# EAGLE design util-vco (EAGLE 6.6.0)
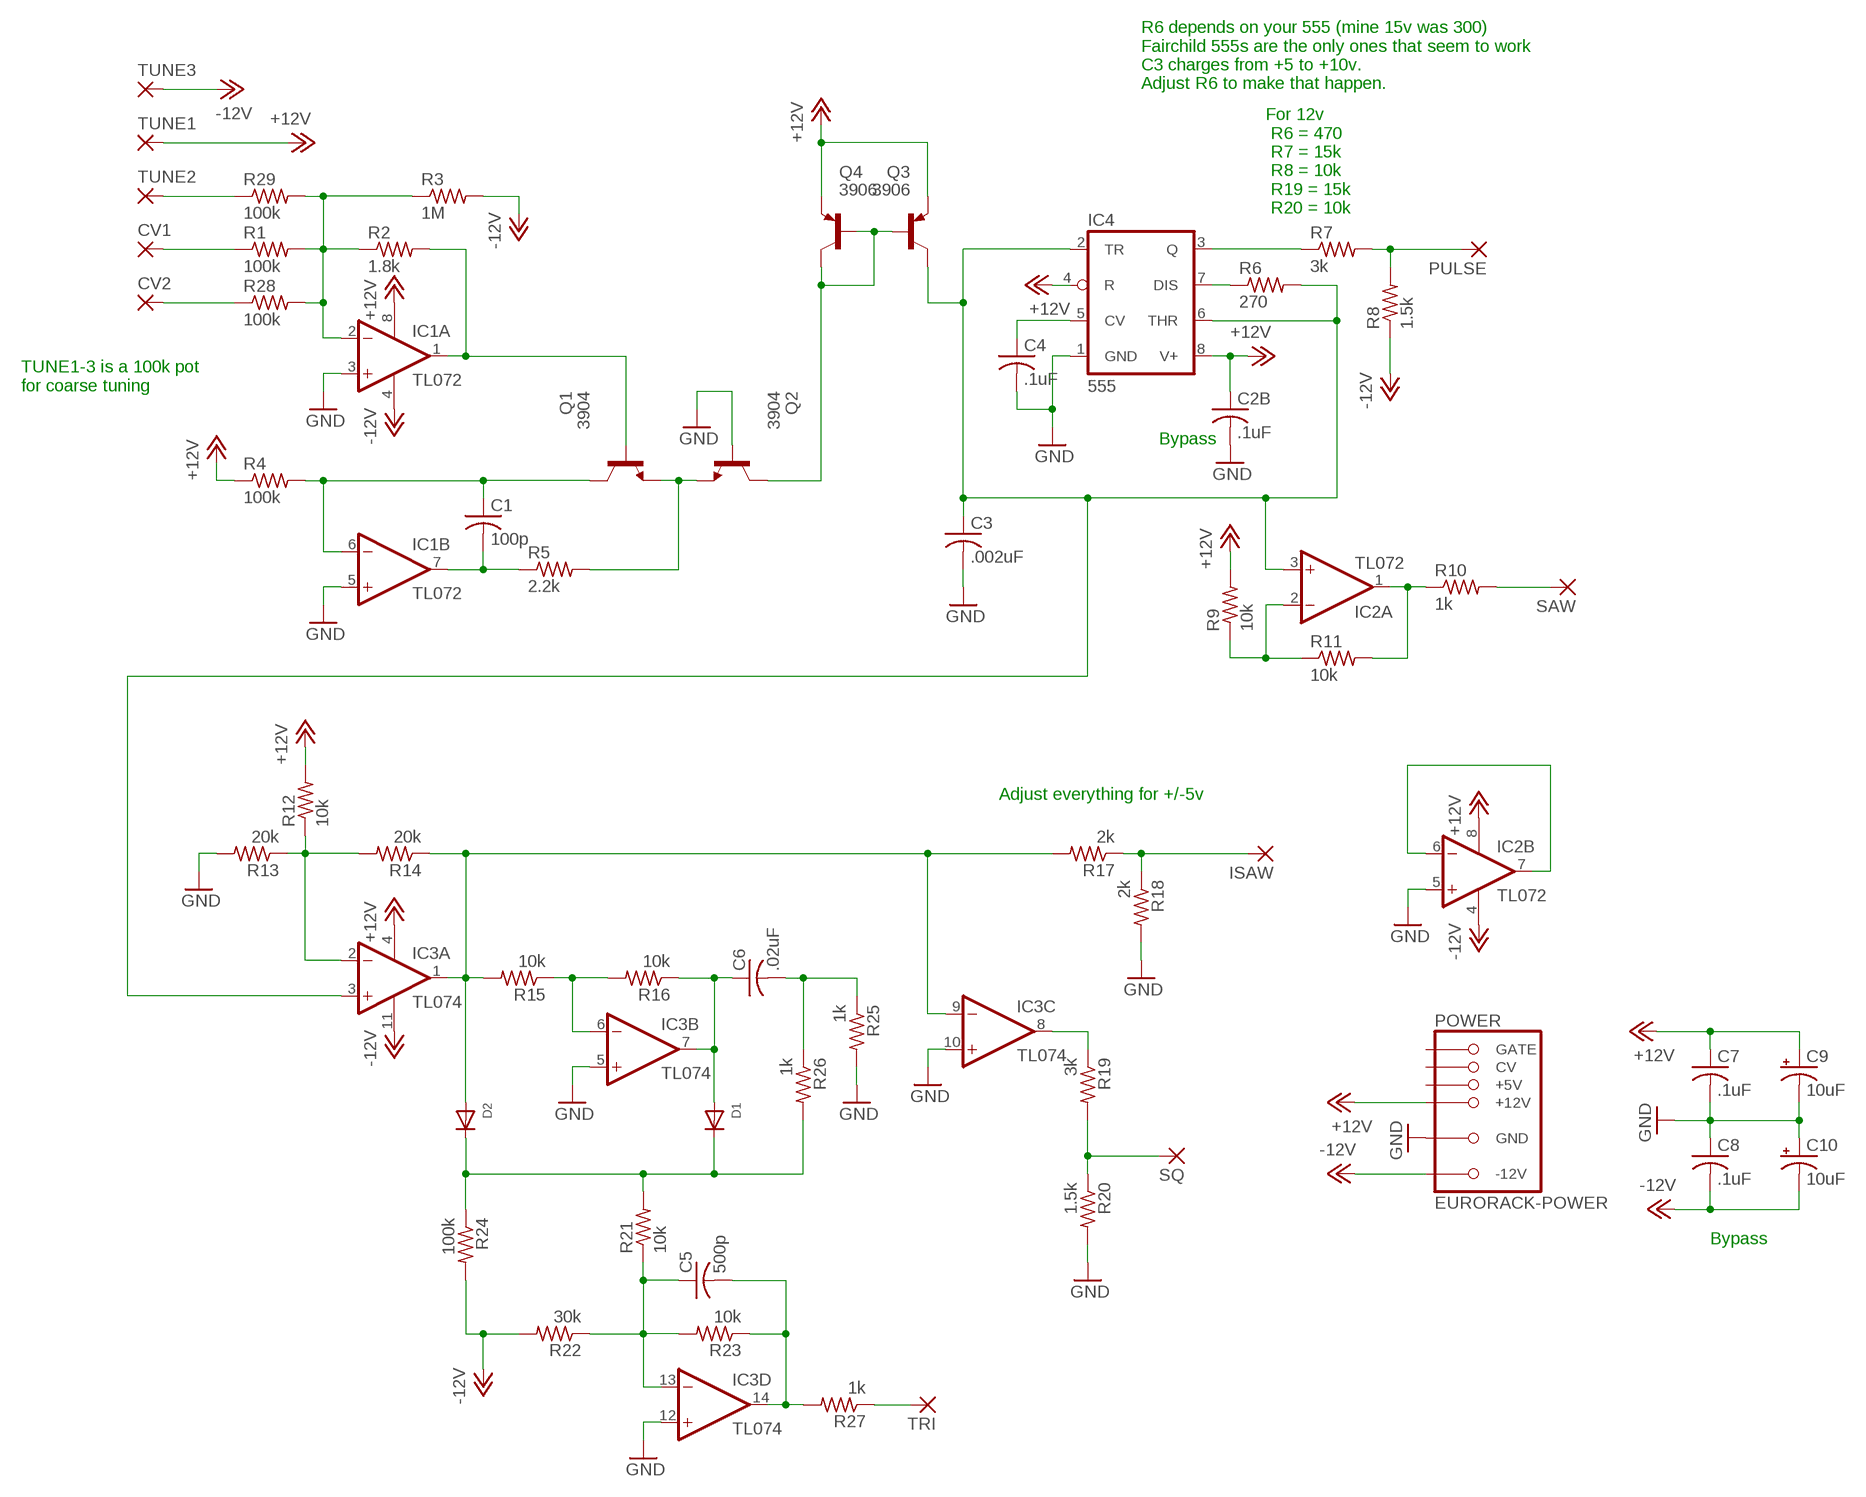
[diagram p0: schematic, sheet 1]

## Parts
C1  100p  C-US050-025X075  [C050-025X075]
C2B  .1uF  C-US050-025X075  [C050-025X075]
C3  .002uF  C-US050-025X075  [C050-025X075]
C4  .1uF  C-US050-025X075  [C050-025X075]
C5  500p  C-US050-025X075  [C050-025X075]
C6  .02uF  C-US050-025X075  [C050-025X075]
C7  .1uF  C-US050-025X075  [C050-025X075]
C8  .1uF  C-US050-025X075  [C050-025X075]
C9  10uF  CPOL-USE2.5-5  [E2,5-5]
C10  10uF  CPOL-USE2.5-5  [E2,5-5]
CV1  2,54/1,0  [2,54/1,0]
CV2  2,54/1,0  [2,54/1,0]
D1  DIODEDO-1N4148  [DO-1N4148]
D2  DIODEDO-1N4148  [DO-1N4148]
IC1  TL072  TL072-TOPP  [DIL08]
IC2  TL072  TL072-TOPP  [DIL08]
IC3  TL074  TL074-TOPP  [DIL14]
IC4  555  LM555N  [DIL08]
ISAW  2,54/1,0  [2,54/1,0]
POWER  EURORACK-POWER  [PINSHRD_PTH_2X8]
PULSE  2,54/1,0  [2,54/1,0]
Q1  3904  2N3904  [TO92]
Q2  3904  2N3904  [TO92]
Q3  3906  2N3906  [TO92]
Q4  3906  2N3906  [TO92]
R1  100k  R-US_0207/10  [0207/10]
R2  1.8k  R-US_0207/10  [0207/10]
R3  1M  R-US_0207/10  [0207/10]
R4  100k  R-US_0207/10  [0207/10]
R5  2.2k  R-US_0207/10  [0207/10]
R6  270  R-US_0207/10  [0207/10]
R7  3k  R-US_0207/10  [0207/10]
R8  1.5k  R-US_0207/10  [0207/10]
R9  10k  R-US_0207/10  [0207/10]
R10  1k  R-US_0207/10  [0207/10]
R11  10k  R-US_0207/10  [0207/10]
R12  10k  R-US_0207/10  [0207/10]
R13  20k  R-US_0207/10  [0207/10]
R14  20k  R-US_0207/10  [0207/10]
R15  10k  R-US_0207/10  [0207/10]
R16  10k  R-US_0207/10  [0207/10]
R17  2k  R-US_0207/10  [0207/10]
R18  2k  R-US_0207/10  [0207/10]
R19  3k  R-US_0207/10  [0207/10]
R20  1.5k  R-US_0207/10  [0207/10]
R21  10k  R-US_0207/10  [0207/10]
R22  30k  R-US_0207/10  [0207/10]
R23  10k  R-US_0207/10  [0207/10]
R24  100k  R-US_0207/10  [0207/10]
R25  1k  R-US_0207/10  [0207/10]
R26  1k  R-US_0207/10  [0207/10]
R27  1k  R-US_0207/10  [0207/10]
R28  100k  R-US_0207/10  [0207/10]
R29  100k  R-US_0207/10  [0207/10]
SAW  2,54/1,0  [2,54/1,0]
SQ  2,54/1,0  [2,54/1,0]
TRI  2,54/1,0  [2,54/1,0]
TUNE1  2,54/1,0  [2,54/1,0]
TUNE2  2,54/1,0  [2,54/1,0]
TUNE3  2,54/1,0  [2,54/1,0]

## Nets
+12V: C2B.1 C7.1 C9.+ IC1.8(P:V+) IC2.8(P:V+) IC3.4(P:V+) IC4.4(R) IC4.8(V+) POWER.+12V@1(+12V) POWER.+12V@2(+12V) Q3.3(E) Q4.3(E) R4.1 R9.2 R12.2 TUNE1.1(P)
-12V: C8.2 C10.- IC1.4(P:V-) IC2.4(P:V-) IC3.11(P:V-) POWER.-12V@1(-12V) POWER.-12V@2(-12V) R3.2 R8.1 R22.2 R24.2 TUNE3.1(P)
GND: C2B.2 C3.2 C4.2 C7.2 C8.1 C9.- C10.+ IC1.3(A:+IN) IC1.5(B:+IN) IC2.5(B:+IN) IC3.5(B:+IN) IC3.10(C:+IN) IC3.12(D:+IN) IC4.1(GND) POWER.GND@1(GND) POWER.GND@2(GND) POWER.GND@3(GND) POWER.GND@4(GND) POWER.GND@5(GND) POWER.GND@6(GND) Q2.2(B) R13.2 R18.2 R20.2 R25.2
N$1: IC1.2(A:-IN) R1.2 R2.1 R3.1 R28.2 R29.2
N$2: IC1.1(A:OUT) Q1.2(B) R2.2
N$3: C1.1 IC1.6(B:-IN) Q1.1(C) R4.2
N$4: C1.2 IC1.7(B:OUT) R5.1
N$5: Q1.3(E) Q2.3(E) R5.2
N$6: C4.1 IC4.5(CV)
N$7: Q2.1(C) Q3.1(C) Q3.2(B) Q4.2(B)
N$8: D2.A IC3.1(A:OUT) IC3.9(C:-IN) R14.1 R15.2 R17.2
N$9: IC4.3(Q) R7.1
N$10: PULSE.1(P) R7.2 R8.2
N$11: IC2.6(B:-IN) IC2.7(B:OUT)
N$12: IC4.7(DIS) R6.1
N$13: IC3.6(B:-IN) R15.1 R16.2
N$14: C6.1 D1.A IC3.7(B:OUT) R16.1
N$15: IC2.2(A:-IN) R9.1 R11.1
N$16: IC2.1(A:OUT) R10.1 R11.2
N$17: R10.2 SAW.1(P)
N$18: IC3.2(A:-IN) R12.1 R13.1 R14.2
N$19: C3.1 IC2.3(A:+IN) IC3.3(A:+IN) IC4.2(TR) IC4.6(THR) Q4.1(C) R6.2
N$20: C6.2 R25.1 R26.1
N$21: D1.C D2.C R21.2 R24.1 R26.2
N$22: C5.1 IC3.13(D:-IN) R21.1 R22.1 R23.2
N$23: C5.2 IC3.14(D:OUT) R23.1 R27.2
N$24: R27.1 TRI.1(P)
N$26: ISAW.1(P) R17.1 R18.1
N$27: IC3.8(C:OUT) R19.1
N$28: R19.2 R20.1 SQ.1(P)
N$29: CV2.1(P) R28.1
N$30: R29.1 TUNE2.1(P)
N$32: CV1.1(P) R1.1
Unconnected: POWER.+5V@1(+5V) POWER.+5V@2(+5V) POWER.CV@1(CV) POWER.CV@2(CV) POWER.GATE@1(GATE) POWER.GATE@2(GATE)

## Notes on the sheet
- R6 depends on your 555 (mine 15v was 300)
  Fairchild 555s are the only ones that seem to work
  C3 charges from +5 to +10v.
  Adjust R6 to make that happen.
- For 12v
   R6 = 470
   R7 = 15k
   R8 = 10k
   R19 = 15k
   R20 = 10k
- TUNE1-3 is a 100k pot
  for coarse tuning
- Bypass
- Adjust everything for +/-5v
- Bypass

## Library data of the parts
C1 C2B C3-C8 = rcl:C-US: CAPACITOR, American symbol
C9 C10 = rcl:CPOL-US: POLARIZED CAPACITOR, American symbol
CV1 CV2 ISAW PULSE SAW SQ TRI TUNE1-TUNE3 = wirepad:2,54/1,0: THROUGH-HOLE PAD
D1 D2 = mmoretti:DIODE: Diode SMADIODE - SMA Surface Mount Package 20V 1A Schottky Diode Digikey: 641-1014-6-ND DO-1N4148 - Through Hole Small Current Diode SOD-123 20V 1 A (.5mV Vf) Schottky Diode - Digikey: MBRX120TPMSCT-ND SOD-323 10V 570mA (.38mV Vf, 3ns) Schottky Diode - Digikey: ZLLS410CT-ND SOD-523 30V 30mA Schottky Diode (RB751S-40TE61) - Digikey: RB751S-40TE61CT-ND SOT23-R/W - SOT23 Package (R = Solder Paste/Reflow Ovens, W = Hand-Soldering) BAT54Film 40V 300mA - Digikey: 497-7162-1-ND
IC1 IC2 = mmoretti:TL072-TOP: OP AMP
IC3 = mmoretti:TL074-TOP: OP AMP
IC4 = linear:*555: TIMER
POWER = mmoretti:EURORACK-POWER
Q1 Q2 = transistor-npn:2N3904: NPN Transistor
Q3 Q4 = transistor-pnp:2N3906: PNP Transistor
R1-R29 = rcl:R-US_: RESISTOR, American symbol

## Board
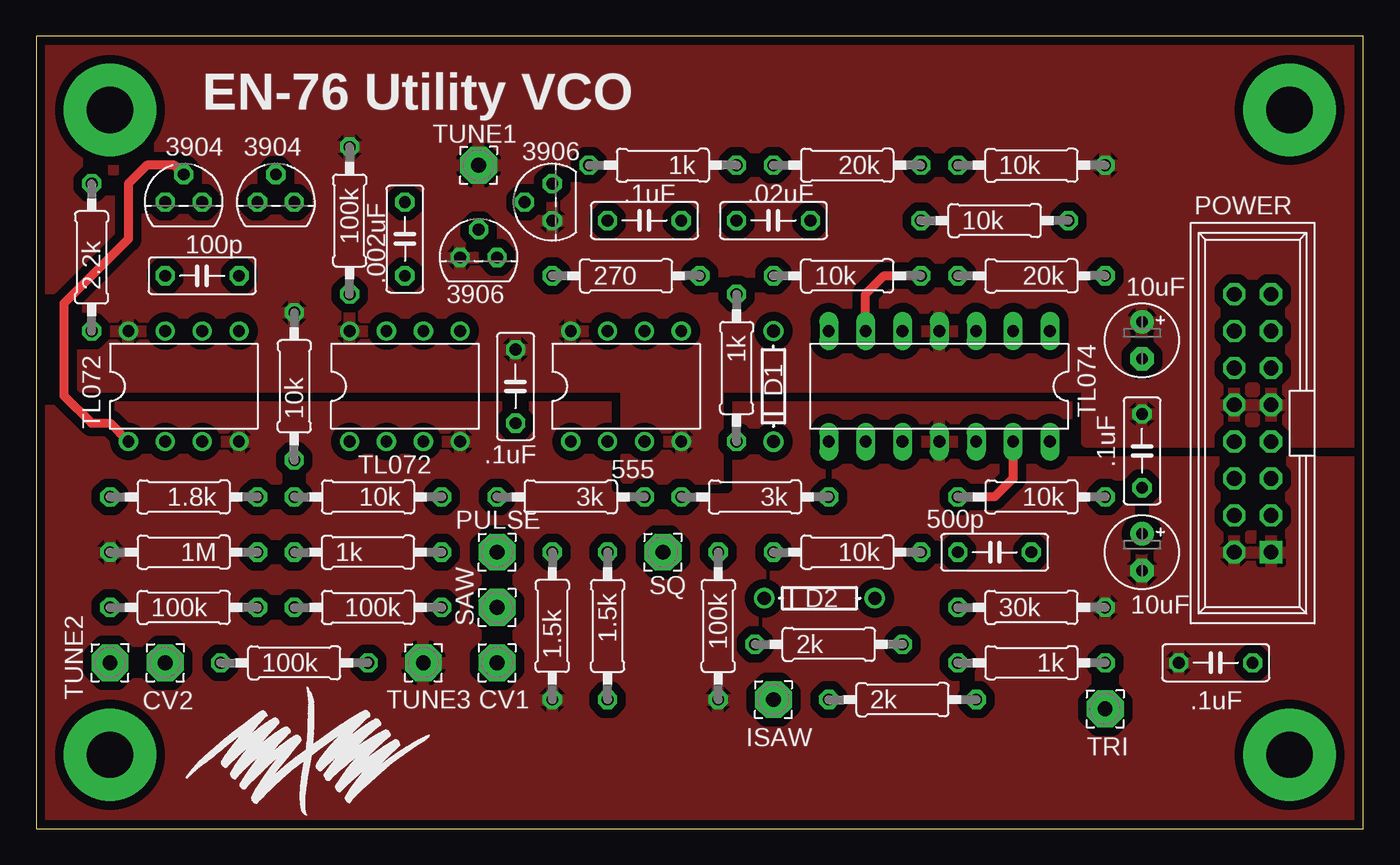
[diagram p1: board, top side]
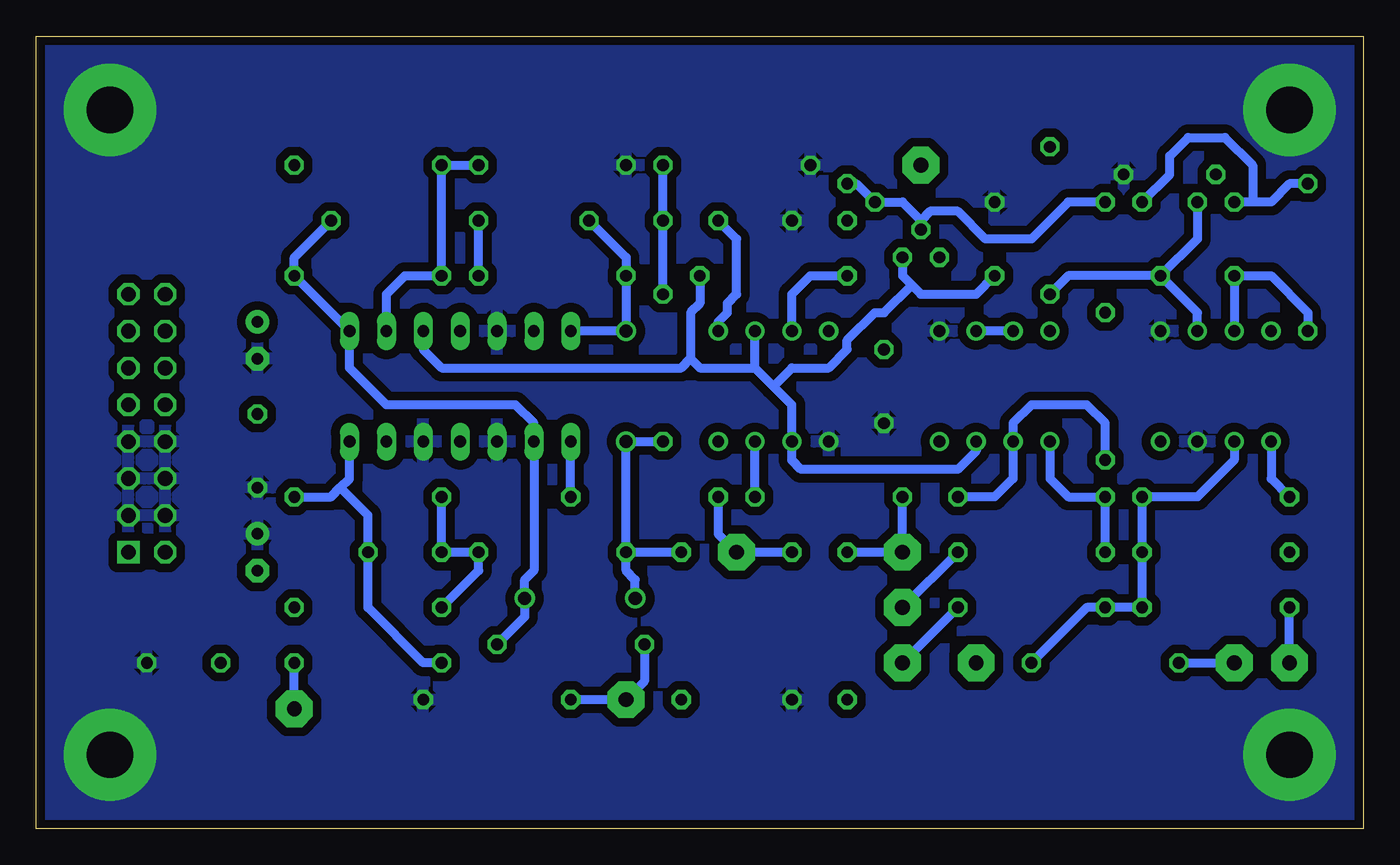
[diagram p2: board, bottom side, seen from below]

Size 91.44 x 54.61 mm. Coordinates in mm from the lower left corner, seen from the top.
Outline: 0,0 91.44,0 91.44,54.61 0,54.61 0,0
Copper layers (1*16): Top 0.035mm / dielectric 1.5mm / Bottom 0.035mm
Design rules "SeeedStudio_2layer_DRU_no_angle_20140221": minimum track width 6mil, minimum drill 12mil, track to track 6mil, track to pad 6mil, pad to pad 6mil, via to via 6mil, smd to smd 0mil, copper to edge 10mil, drill to drill 10mil, minimum pad ring 10mil, minimum via ring 6mil, stop-mask expansion 2mil, vias tented up to drill 100mil, thermal gap 10mil

### Footprints (pad centres in the part's own frame; a part is rotated, then mirrored left to right if it is on the bottom)
C050-025X075 = drill 0.813 octagon: 1 -2.54,0; 2 2.54,0
E2,5-5 = drill 0.813 pad 1.6: + -1.27,0 | drill 0.813 pad 1.6 octagon: - 1.27,0
2,54/1,0 = drill 1.016 pad 2.54 octagon: 1 0,0
DO-1N4148 = drill 0.9: A -3.81,0; C 3.81,0
DIL08 = drill 0.813 pad 1.27: 1 -3.81,-3.81; 2 -1.27,-3.81; 3 1.27,-3.81; 4 3.81,-3.81; 5 3.81,3.81; 6 1.27,3.81; 7 -1.27,3.81; 8 -3.81,3.81
DIL14 = drill 0.813 long: 1 -7.62,-3.81; 2 -5.08,-3.81; 3 -2.54,-3.81; 4 0,-3.81; 5 2.54,-3.81; 6 5.08,-3.81; 7 7.62,-3.81; 8 7.62,3.81; 9 5.08,3.81; 10 2.54,3.81; 11 0,3.81; 12 -2.54,3.81; 13 -5.08,3.81; 14 -7.62,3.81
PINSHRD_PTH_2X8 = drill 1.016 octagon: +5V@1 3.81,1.27; +5V@2 3.81,-1.27; +12V@1 1.27,1.27; +12V@2 1.27,-1.27; -12V@1 -8.89,1.27; CV@1 6.35,1.27; CV@2 6.35,-1.27; GATE@1 8.89,1.27; GATE@2 8.89,-1.27; GND@1 -6.35,1.27; GND@2 -6.35,-1.27; GND@3 -3.81,1.27; GND@4 -3.81,-1.27; GND@5 -1.27,1.27; GND@6 -1.27,-1.27 | drill 1.016 square: -12V@2 -8.89,-1.27
TO92 = drill 0.813 octagon: 1 1.27,0; 2 0,1.905; 3 -1.27,0
0207/10 = drill 0.813 octagon: 1 -5.08,0; 2 5.08,0

### Placement (x,y rotation side)
C1  11.43,38.1 180 top
C2B  33.02,30.48 270 top
C3  25.4,40.64 90 top
C4  41.91,41.91 180 top
C5  66.04,19.05 0 top
C6  50.8,41.91 180 top
C7  76.2,26.04 270 top
C8  81.28,11.43 180 top
C9  76.2,33.66 270 top
C10  76.2,19.05 270 top
CV1  31.75,11.43 0 top
CV2  8.89,11.43 0 top
D1  50.8,30.48 270 top
D2  53.98,15.88 180 top
IC1  10.16,30.48 0 top
IC2  25.4,30.48 0 top
IC3  62.23,30.48 180 top
IC4  40.64,30.48 0 top
ISAW  50.8,8.89 0 top
POWER  83.82,27.94 90 top
PULSE  31.75,19.05 0 top
Q1  10.16,43.18 0 top
Q2  16.51,43.18 0 top
Q3  35.56,43.18 90 top
Q4  30.48,39.37 0 top
R1  22.86,15.24 180 top
R2  10.16,22.86 180 top
R3  10.16,19.05 180 top
R4  21.59,41.91 270 top
R5  3.81,39.37 90 top
R6  40.64,38.1 0 top
R7  36.83,22.86 180 top
R8  35.56,13.97 90 top
R9  17.78,30.48 90 top
R10  22.86,19.05 0 top
R11  22.86,22.86 180 top
R12  68.58,45.72 0 top
R13  55.88,45.72 180 top
R14  68.58,38.1 180 top
R15  66.04,41.91 0 top
R16  55.88,38.1 0 top
R17  54.61,12.7 0 top
R18  59.69,8.89 0 top
R19  49.53,22.86 180 top
R20  39.37,13.97 270 top
R21  55.88,19.05 180 top
R22  68.58,15.24 0 top
R23  68.58,22.86 180 top
R24  46.99,13.97 270 top
R25  43.18,45.72 180 top
R26  48.26,31.75 270 top
R27  68.58,11.43 180 top
R28  17.78,11.43 0 top
R29  10.16,15.24 0 top
SAW  31.75,15.24 0 top
SQ  43.18,19.05 0 top
TRI  73.66,8.26 0 top
TUNE1  30.48,45.72 0 top
TUNE2  5.08,11.43 0 top
TUNE3  26.67,11.43 0 top

### Tracks (layer width: path | path; a pad name or v marks a point on that pad's centre or on a via)
+12V
  pour Top (isolate 0.61): 0,30.48 40.64,30.48 40.64,24.13 46.99,24.13 46.99,30.48 91.44,30.48 91.44,54.61 0,54.61
  pour Top (isolate 0.61): 72.39,30.48 72.39,26.67 91.44,26.67 91.44,33.02 72.39,33.02
-12V
  pour Top (isolate 0.61, rank 2): 0,0 91.44,0 91.44,30.48 46.99,30.48 46.99,24.13 40.64,24.13 40.64,30.48 0,30.48
GND  (via drill 3.17 pad 6.35)
  other vias: 5.08,49.53 5.08,5.08 86.36,49.53 86.36,5.08
  pour Bottom (isolate 0.61): 0,54.61 91.44,54.61 91.44,0 0,0
N$1
  Bottom 0.61: IC1.2 8.89,25.4 11.43,22.86 R2.1 R3.1 R29.2 R1.2 19.05,15.24 R28.2
N$2
  Top 0.61: Q1.2 9.53,45.72 7.62,45.72 6.35,44.45 6.35,40.64 1.91,36.2 1.91,29.84 3.81,27.94 5.08,27.94 IC1.1
  Bottom 0.61: IC1.1 6.35,24.13 R2.2
N$3
  Bottom 0.61: Q1.1 11.43,40.64 C1.1 | IC1.6 11.43,35.56 C1.1 | C1.1 20.32,38.1 R4.2
N$4
  Bottom 0.61: IC1.7 C1.2 6.35,38.1 3.81,35.56 R5.1
N$5
  Bottom 0.61: R5.2 5.08,44.45 6.35,43.18 7.62,43.18 | 7.62,43.18 Q1.3 | Q2.3 13.34,45.09 13.34,46.35 12.06,47.62 9.53,47.62 7.62,45.72 7.62,43.18
N$6
  Bottom 0.61: IC4.5 44.45,34.92 43.81,35.56 43.81,36.2 43.18,36.83 43.18,40.64 C4.1
N$7
  Bottom 0.61: Q2.1 20.32,43.18 22.86,40.64 26.04,40.64 27.94,42.55 29.84,42.55 30.48,41.91 | 30.48,41.91 Q4.2 | Q3.1 34.92,44.45 Q3.2 31.75,43.18 30.48,41.91
N$8
  Bottom 0.61: R15.2 73.66,39.37 R14.1 IC3.1 69.85,31.75 67.31,29.21 58.42,29.21 57.15,27.94 IC3.9 57.15,17.78 57.78,17.14 D2.A 57.78,14.61 R17.2
N$9
  Bottom 0.61: R7.1 IC4.3
N$10
  Bottom 0.61: R7.2 PULSE.1 R8.2
N$11
  Bottom 0.61: IC2.7 IC2.6
N$12
  Bottom 0.61: IC4.7 39.37,36.83 38.1,38.1 R6.1
N$13
  Top 0.61: IC3.6 57.15,36.83 58.42,38.1 R16.2
  Bottom 0.61: R16.2 R15.1
N$14
  Bottom 0.61: C6.1 50.8,39.37 R16.1 D1.A IC3.7
N$15
  Bottom 0.61: R9.1 17.78,27.94 19.05,29.21 22.86,29.21 24.13,27.94 IC2.2 24.13,24.13 25.4,22.86 R11.1
N$16
  Bottom 0.61: R10.1 R11.2 20.32,22.86 21.59,24.13 IC2.1
N$17
  Bottom 0.61: R10.2 SAW.1
N$18
  Bottom 0.61: IC3.2 67.31,36.83 66.04,38.1 R14.2 R12.1 R13.1
N$19
  Bottom 0.61: Q4.1 31.75,38.1 31.11,37.47 | 31.11,37.47 30.48,36.83 26.67,36.83 C3.1 | IC2.3 26.67,26.04 27.94,24.77 38.73,24.77 39.37,25.4 IC4.2 39.37,29.21 40.64,30.48 | 40.64,30.48 41.91,31.75 | 41.91,31.75 IC4.6 | R6.2 45.72,36.2 46.35,35.56 46.35,32.38 | 46.35,32.38 45.72,31.75 41.91,31.75 | IC3.3 64.77,33.02 63.5,31.75 46.99,31.75 46.35,32.38 | 40.64,30.48 39.37,31.75 36.83,31.75 35.56,33.02 35.56,33.66 33.66,35.56 33.02,35.56 31.11,37.47
N$20
  Bottom 0.61: R26.1 C6.2 R25.1
N$21
  Bottom 0.61: R24.1 R21.2 | R21.2 D1.C R26.2 | D2.C 50.16,17.14 50.8,17.78 R21.2
N$22
  Top 0.61: IC3.13 67.31,24.13 66.04,22.86 R23.2
  Bottom 0.61: R22.1 60.96,17.78 R21.1 C5.1 R23.2
N$23
  Bottom 0.61: R23.1 71.12,22.86 70.48,23.5 | 70.48,23.5 69.85,24.13 IC3.14 | R27.2 64.77,11.43 68.58,15.24 C5.2 68.58,21.59 70.48,23.5
N$24
  Bottom 0.61: TRI.1 R27.1
N$26
  Bottom 0.61: R17.1 49.53,10.16 ISAW.1 R18.1
N$27
  Bottom 0.61: R19.1 IC3.8
N$28
  Bottom 0.61: R20.1 SQ.1 44.45,20.32 R19.2
N$29
  Bottom 0.61: R28.1 CV2.1
N$30
  Bottom 0.61: TUNE2.1 R29.1
N$32
  Bottom 0.61: R1.1 CV1.1

### Text on the board
tPlace: EN-76 Utility VCO